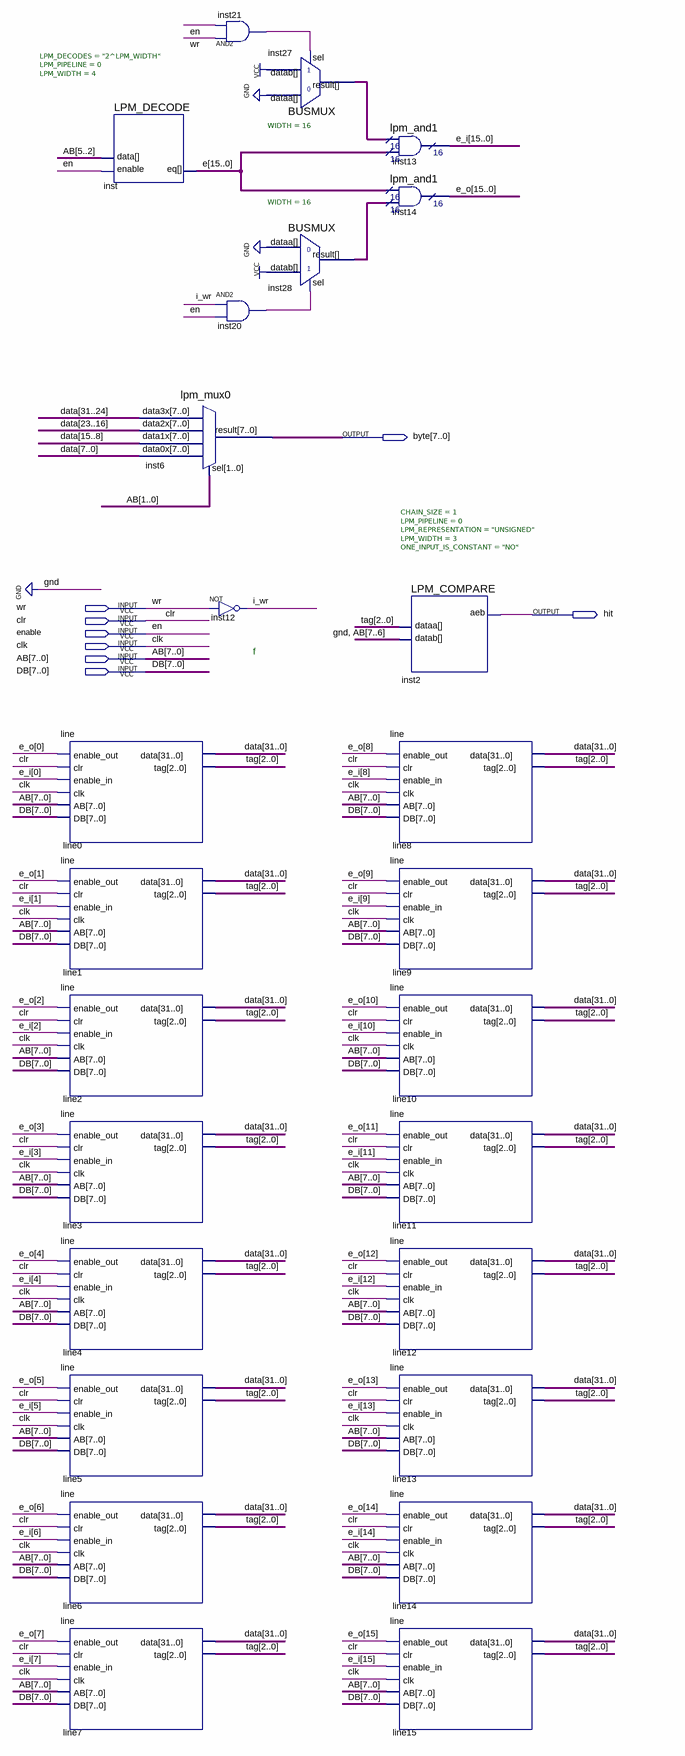
[diagram p0: schematic sheet]
// Quartus schematic cache_lines.bdf as structural Verilog: 26 symbols, 8 pins
module cache_lines (
  input  wr,
  input  clr,
  input  enable,
  input  clk,
  input  [7:0] AB,
  input  [7:0] DB,
  output [7:0] \byte ,
  output hit
);

  wire i_wr, inst20_out, inst21_out;
  wire [2:0] tag;
  wire [15:0] e, e_i, e_o, inst27_result, inst28_result;
  wire [31:0] data;

  line line0 (.enable_out(e_o[0]), .clr(clr), .enable_in(e_i[0]), .clk(clk), .AB(AB), .DB(DB), .data(data), .tag(tag));
  line line1 (.enable_out(e_o[1]), .clr(clr), .enable_in(e_i[1]), .clk(clk), .AB(AB), .DB(DB), .data(data), .tag(tag));
  line line2 (.enable_out(e_o[2]), .clr(clr), .enable_in(e_i[2]), .clk(clk), .AB(AB), .DB(DB), .data(data), .tag(tag));
  line line3 (.enable_out(e_o[3]), .clr(clr), .enable_in(e_i[3]), .clk(clk), .AB(AB), .DB(DB), .data(data), .tag(tag));
  line line4 (.enable_out(e_o[4]), .clr(clr), .enable_in(e_i[4]), .clk(clk), .AB(AB), .DB(DB), .data(data), .tag(tag));
  line line5 (.enable_out(e_o[5]), .clr(clr), .enable_in(e_i[5]), .clk(clk), .AB(AB), .DB(DB), .data(data), .tag(tag));
  line line6 (.enable_out(e_o[6]), .clr(clr), .enable_in(e_i[6]), .clk(clk), .AB(AB), .DB(DB), .data(data), .tag(tag));
  line line7 (.enable_out(e_o[7]), .clr(clr), .enable_in(e_i[7]), .clk(clk), .AB(AB), .DB(DB), .data(data), .tag(tag));
  LPM_DECODE #(.LPM_DECODES("2^LPM_WIDTH"), .LPM_PIPELINE(0), .LPM_WIDTH(4)) inst (
    .enable(enable), .data(AB[5:2]), .eq(e));
  lpm_mux0 inst6 (
    .data3x(data[31:24]), .data2x(data[23:16]), .data1x(data[15:8]), .data0x(data[7:0]), .sel(AB[1:0]),
    .result(\byte ));
  and inst21 (inst21_out, wr, enable);
  and inst20 (inst20_out, i_wr, enable);
  not inst12 (i_wr, wr);
  BUSMUX #(.WIDTH(16)) inst27 (.datab({16{1'b1}}), .sel(inst21_out), .dataa({16{1'b0}}), .result(inst27_result));
  BUSMUX #(.WIDTH(16)) inst28 (.datab({16{1'b1}}), .sel(inst20_out), .dataa({16{1'b0}}), .result(inst28_result));
  lpm_and1 inst13 (.data0x(inst27_result), .data1x(e), .result(e_i));
  lpm_and1 inst14 (.data0x(e), .data1x(inst28_result), .result(e_o));
  line line8 (.enable_out(e_o[8]), .clr(clr), .enable_in(e_i[8]), .clk(clk), .AB(AB), .DB(DB), .data(data), .tag(tag));
  line line9 (.enable_out(e_o[9]), .clr(clr), .enable_in(e_i[9]), .clk(clk), .AB(AB), .DB(DB), .data(data), .tag(tag));
  line line10 (
    .enable_out(e_o[10]), .clr(clr), .enable_in(e_i[10]), .clk(clk), .AB(AB), .DB(DB), .data(data), .tag(tag));
  line line11 (
    .enable_out(e_o[11]), .clr(clr), .enable_in(e_i[11]), .clk(clk), .AB(AB), .DB(DB), .data(data), .tag(tag));
  line line12 (
    .enable_out(e_o[12]), .clr(clr), .enable_in(e_i[12]), .clk(clk), .AB(AB), .DB(DB), .data(data), .tag(tag));
  line line13 (
    .enable_out(e_o[13]), .clr(clr), .enable_in(e_i[13]), .clk(clk), .AB(AB), .DB(DB), .data(data), .tag(tag));
  line line14 (
    .enable_out(e_o[14]), .clr(clr), .enable_in(e_i[14]), .clk(clk), .AB(AB), .DB(DB), .data(data), .tag(tag));
  line line15 (
    .enable_out(e_o[15]), .clr(clr), .enable_in(e_i[15]), .clk(clk), .AB(AB), .DB(DB), .data(data), .tag(tag));
  LPM_COMPARE #(.CHAIN_SIZE(1), .LPM_PIPELINE(0), .LPM_REPRESENTATION("UNSIGNED"), .LPM_WIDTH(3), .ONE_INPUT_IS_CONSTANT("NO")) inst2 (
    .dataa(tag), .datab({1'b0, AB[7:6]}), .aeb(hit));

  // Other names for the same wires on the sheet: en = enable

  // Notes on the sheet:
  //   f
endmodule
